# EAGLE design dcc-a-star32U (EAGLE 7.2.0)
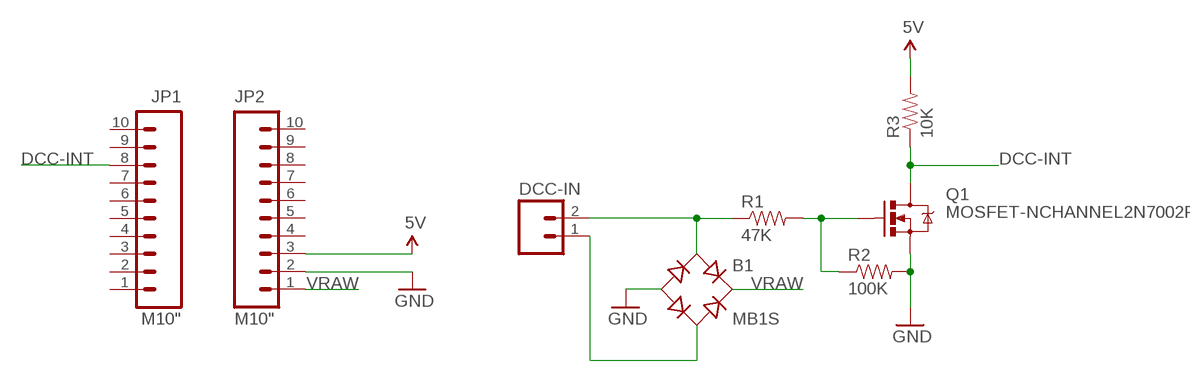
[diagram p0: schematic, sheet 1]

## Parts
B1  MB1S  [SOIC-4]
DCC-IN  M02-JST-2-PTH-NO_SILK  [JST-2-PTH-NS]
JP1  M10"  [1X10]
JP2  M10"  [1X10]
Q1  MOSFET-NCHANNEL2N7002PW  [SOT323]
R1  47K  RESISTOR0603-RES  [0603-RES]
R2  100K  RESISTOR0603-RES  [0603-RES]
R3  10K  RESISTOR0603-RES  [0603-RES]

## Nets
5V: JP2.3 R3.2
DCC-INT: JP1.8 Q1.3(D) R3.1
GND: B1.- JP2.2 Q1.2(S) R2.2
N$1: Q1.1(G) R1.2 R2.1
N$3: B1.~1(AC1) DCC-IN.2 R1.1
N$4: B1.~2(AC2) DCC-IN.1
VRAW: B1.+ JP2.1
Unconnected: JP1.1 JP1.2 JP1.3 JP1.4 JP1.5 JP1.6 JP1.7 JP1.9 JP1.10 JP2.4 JP2.5 JP2.6 JP2.7 JP2.8 JP2.9 JP2.10

## Library data of the parts
B1 = rectifier:MB*S: Bridge Rectifier Source: http://www.fairchildsemi.com/ds/MB/MB6S.pdf
DCC-IN = SparkFun-Connectors:M02: Standard 2-pin 0.1" header. Use with - straight break away headers ( PRT-00116) - right angle break away headers (PRT-00553) - swiss pins (PRT-00743) - machine pins (PRT-00117) - female headers (PRT-00115) Molex polarized connector foot print use with: PRT-08233 with associated crimp pins and housings. 2.54_SCREWTERM for use with PRT-10571. 3.5mm Screw Terminal footprints for PRT-08084 5mm Screw Terminal footprints for use with PRT-08433
JP1 JP2 = SparkFun-Connectors:M10: Header 10 Standard 10-pin 0.1" header. Use with straight break away headers (SKU : PRT-00116), right angle break away headers (PRT-00553), swiss pins (PRT-00743), machine pins (PRT-00117), and female headers (PRT-00115).
Q1 = SparkFun-DiscreteSemi:MOSFET-NCHANNEL: Common NMOSFET Parts MFG P/N Store ID Prod ID FDD8780 TRANS-09984 SI7820DN TRANS-11055 FDS6630A IC-08089 2N7002PW TRANS-11151 FQP30N06L COM-10213 TRANS-10060 BSS123LT1G TRANS-08345 BSS138 TRANS-00830 BS170 2N7000; PROD_ID: TRANS-11151
R1-R3 = SparkFun-Passives:RESISTOR: Resistor Basic schematic elements and footprints for 0603, 1206, and PTH resistors.

## Board
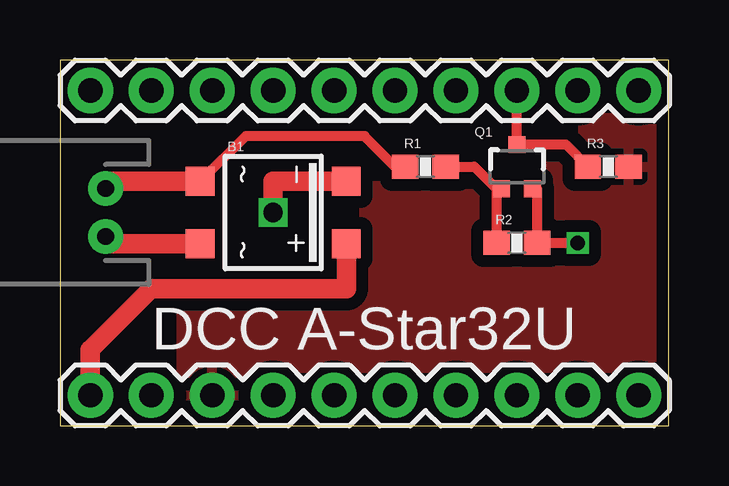
[diagram p1: board, top side]
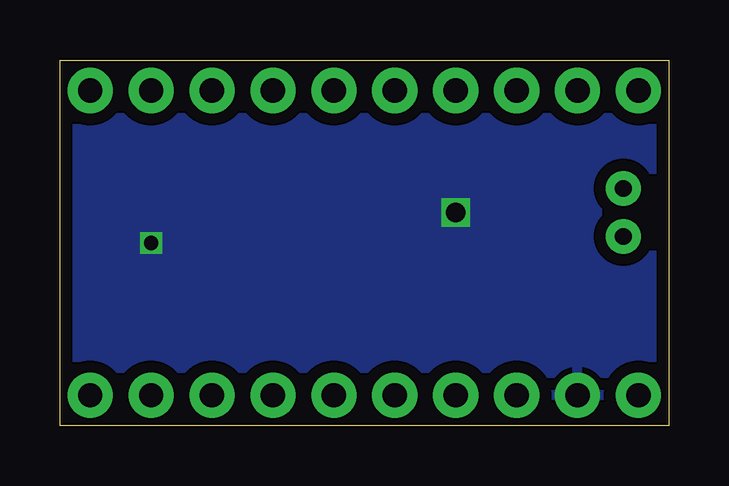
[diagram p2: board, bottom side, seen from below]

Size 25.39 x 15.24 mm. Coordinates in mm from the lower left corner, seen from the top.
Outline: 0,15.24 0,0 25.39,0 25.39,15.24 0,15.24
Copper layers (1*2*15*16): Top 0.035mm / dielectric 0.2mm / Route2 0.0175mm / dielectric 1.1mm / Route15 0.0175mm / dielectric 0.2mm / Bottom 0.035mm
Design rules "SeeedStudio_DRU_no_angle_20130527": minimum track width 6mil, minimum drill 12mil, track to track 6mil, track to pad 6mil, pad to pad 6mil, via to via 6mil, smd to smd 0mil, copper to edge 10mil, drill to drill 10mil, minimum pad ring 6mil, minimum via ring 6mil, stop-mask expansion 2mil, vias tented up to drill 25mil, thermal gap 10mil

### Footprints (pad centres in the part's own frame; a part is rotated, then mirrored left to right if it is on the bottom)
SOIC-4 = smd 1.2 x 1.2: + 1.3,3.05; - -1.3,3.05; ~1 -1.3,-3.05; ~2 1.3,-3.05
JST-2-PTH-NS = drill 0.7 pad 1.448: 1 -1,0; 2 1,0
1X10 = drill 1.016 pad 1.88: 1 0,0; 2 2.54,0; 3 5.08,0; 4 7.62,0; 5 10.16,0; 6 12.7,0; 7 15.24,0; 8 17.78,0; 9 20.32,0; 10 22.86,0
SOT323 = smd 0.7 x 0.7: 1 -0.65,-0.925; 2 0.65,-0.925; 3 0,0.925
0603-RES = smd 1.1 x 1: 1 -0.85,0; 2 0.85,0

### Placement (x,y rotation side)
B1  8.89,8.89 270 top
DCC-IN  1.91,8.89 90 top
JP1  1.27,13.97 0 top
JP2  1.27,1.27 0 top
Q1  19.05,10.8 0 top
R1  15.24,10.8 0 top
R2  19.05,7.62 0 top
R3  22.86,10.8 0 top

### Tracks (layer width: path | path; a pad name or v marks a point on that pad's centre or on a via)
5V
  pour Top (isolate 0.508): 12.7,13.97 25.4,13.97 25.4,0 5.08,0 5.08,5.08 12.7,5.08
DCC-INT
  Top 0.406: JP1.8 Q1.3 21.09,11.72 R3.1
GND  (via drill 0.6, 0.8)
  Top 0.406: Q1.2 19.9,9.87 R2.2 v21.59,7.62
  Top 0.813: B1.- 8.89,10.19 v8.89,8.89
  pour Bottom (isolate 0.508): 0,15.24 25.4,15.24 25.4,0 0,0
N$1
  Top 0.406: R1.2 17.27,10.8 18.2,9.87 | 18.2,9.87 R2.1 | Q1.1 18.2,9.87
N$3
  Top 0.406: R1.1 13.97,10.8 12.7,12.07 7.75,12.07 B1.~1
  Top 0.813: B1.~1 1.94,10.19 DCC-IN.2
N$4
  Top 0.813: B1.~2 1.91,7.59 DCC-IN.1
VRAW
  Top 0.813: JP2.1 1.27,3.17 3.81,5.72 11.94,5.72 B1.+

### Text on the board
tPlace: DCC A-Star32U